# EAGLE schematic KombyPiPi (EAGLE 7.2.0)
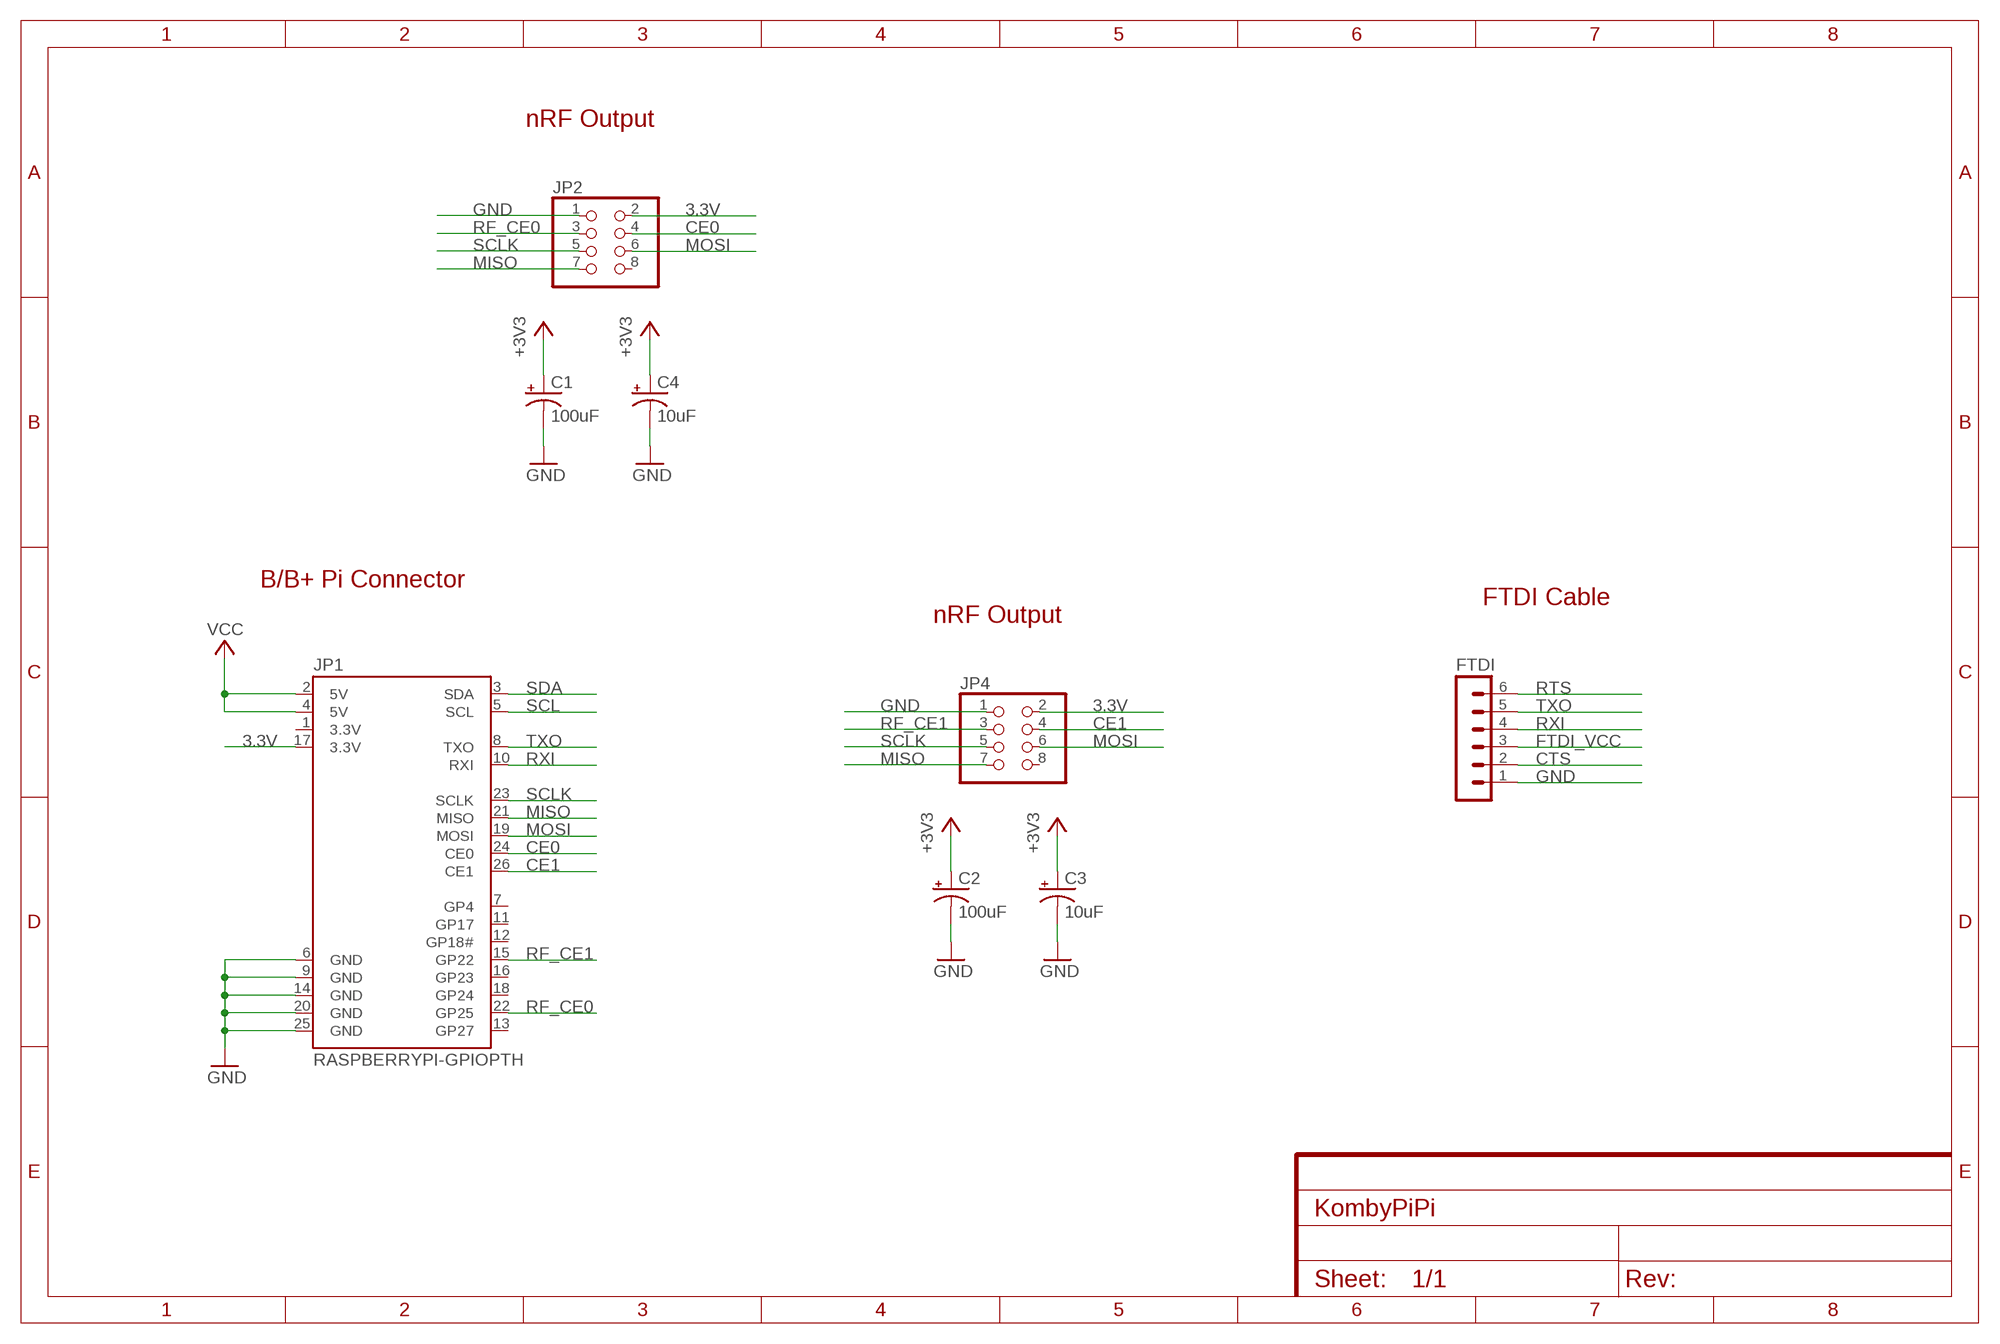
[diagram p0: schematic, sheet 1]

## Parts
C1  100uF  CAP_POLPTH1  [CPOL-RADIAL-100UF-25V]
C2  100uF  CAP_POLPTH1  [CPOL-RADIAL-100UF-25V]
C3  10uF  CAP_POLPTH2  [CPOL-RADIAL-10UF-25V]
C4  10uF  CAP_POLPTH2  [CPOL-RADIAL-10UF-25V]
FTDI  MA06-1  [MA06-1]
JP1  RASPBERRYPI-GPIOPTH  [2X13-SHROUDED]
JP2  PINHD-2X4  [2X04]
JP4  PINHD-2X4  [2X04]

## Nets
3.3V [RFBoard]: C1.1(+) C2.1(+) C3.1(+) C4.1(+) JP1.17(3.3V) JP2.2 JP4.2 ; supply symbol labelled +3V3
CE0: JP1.24(CE0) JP2.4
CE1 [RFBoard]: JP1.26(CE1) JP4.4
CTS: FTDI.2
FTDI_VCC: FTDI.3
GND: C1.2(-) C2.2(-) C3.2(-) C4.2(-) FTDI.1 JP1.6(GND) JP1.9(GND) JP1.14(GND) JP1.20(GND) JP1.25(GND) JP2.1 JP4.1
MISO [RFBoard]: JP1.21(MISO) JP2.7 JP4.7
MOSI [RFBoard]: JP1.19(MOSI) JP2.6 JP4.6
RF_CE0: JP1.22(GP25) JP2.3
RF_CE1 [RFBoard]: JP1.15(GP22) JP4.3
RTS: FTDI.6
RXI: FTDI.4 JP1.10(RXI)
SCL: JP1.5(SCL)
SCLK: JP1.23(SCLK) JP2.5 JP4.5
SDA: JP1.3(SDA)
TXO: FTDI.5 JP1.8(TXO)
VCC: JP1.2(5V) JP1.4(5V)
Unconnected: JP1.7(GP4) JP1.11(GP17) JP1.12(GP18#) JP1.13(GP27) JP1.16(GP23) JP1.18(GP24) JP2.8 JP4.8

## Notes on the sheet
- nRF Output
- B/B+ Pi Connector
- FTDI Cable
- nRF Output

## Power pins joined to a net without a drawn wire
3.3V: JP1.1(3.3V)

## Library data of the parts
C1-C4 = SparkFun:CAP_POL: Capacitor Polarized These are standard SMD and PTH capacitors. Normally 10uF, 47uF, and 100uF in electrolytic and tantalum varieties. Always verify the external diameter of the through hole cap, it varies with capacity, voltage, and manufacturer. The EIA devices should be standard.
FTDI = con-lstb:MA06-1: PIN HEADER; OC_FARNELL: unknown; OC_NEWARK: unknown
JP1 = SparkFun-Boards:RASPBERRYPI-GPIO: RASPBERRY PI I/O HEADER As defined for the Revistion 2 Pi.; DIST: sparkfun; DIST_ID: PRT-11490
JP2 JP4 = adafruit:PINHD-2X4: PIN HEADER

## Net classes
1 RFBoard: width 0.406 mm